# EAGLE schematic PULSE-SIEM_V2 (EAGLE 9.5.1)
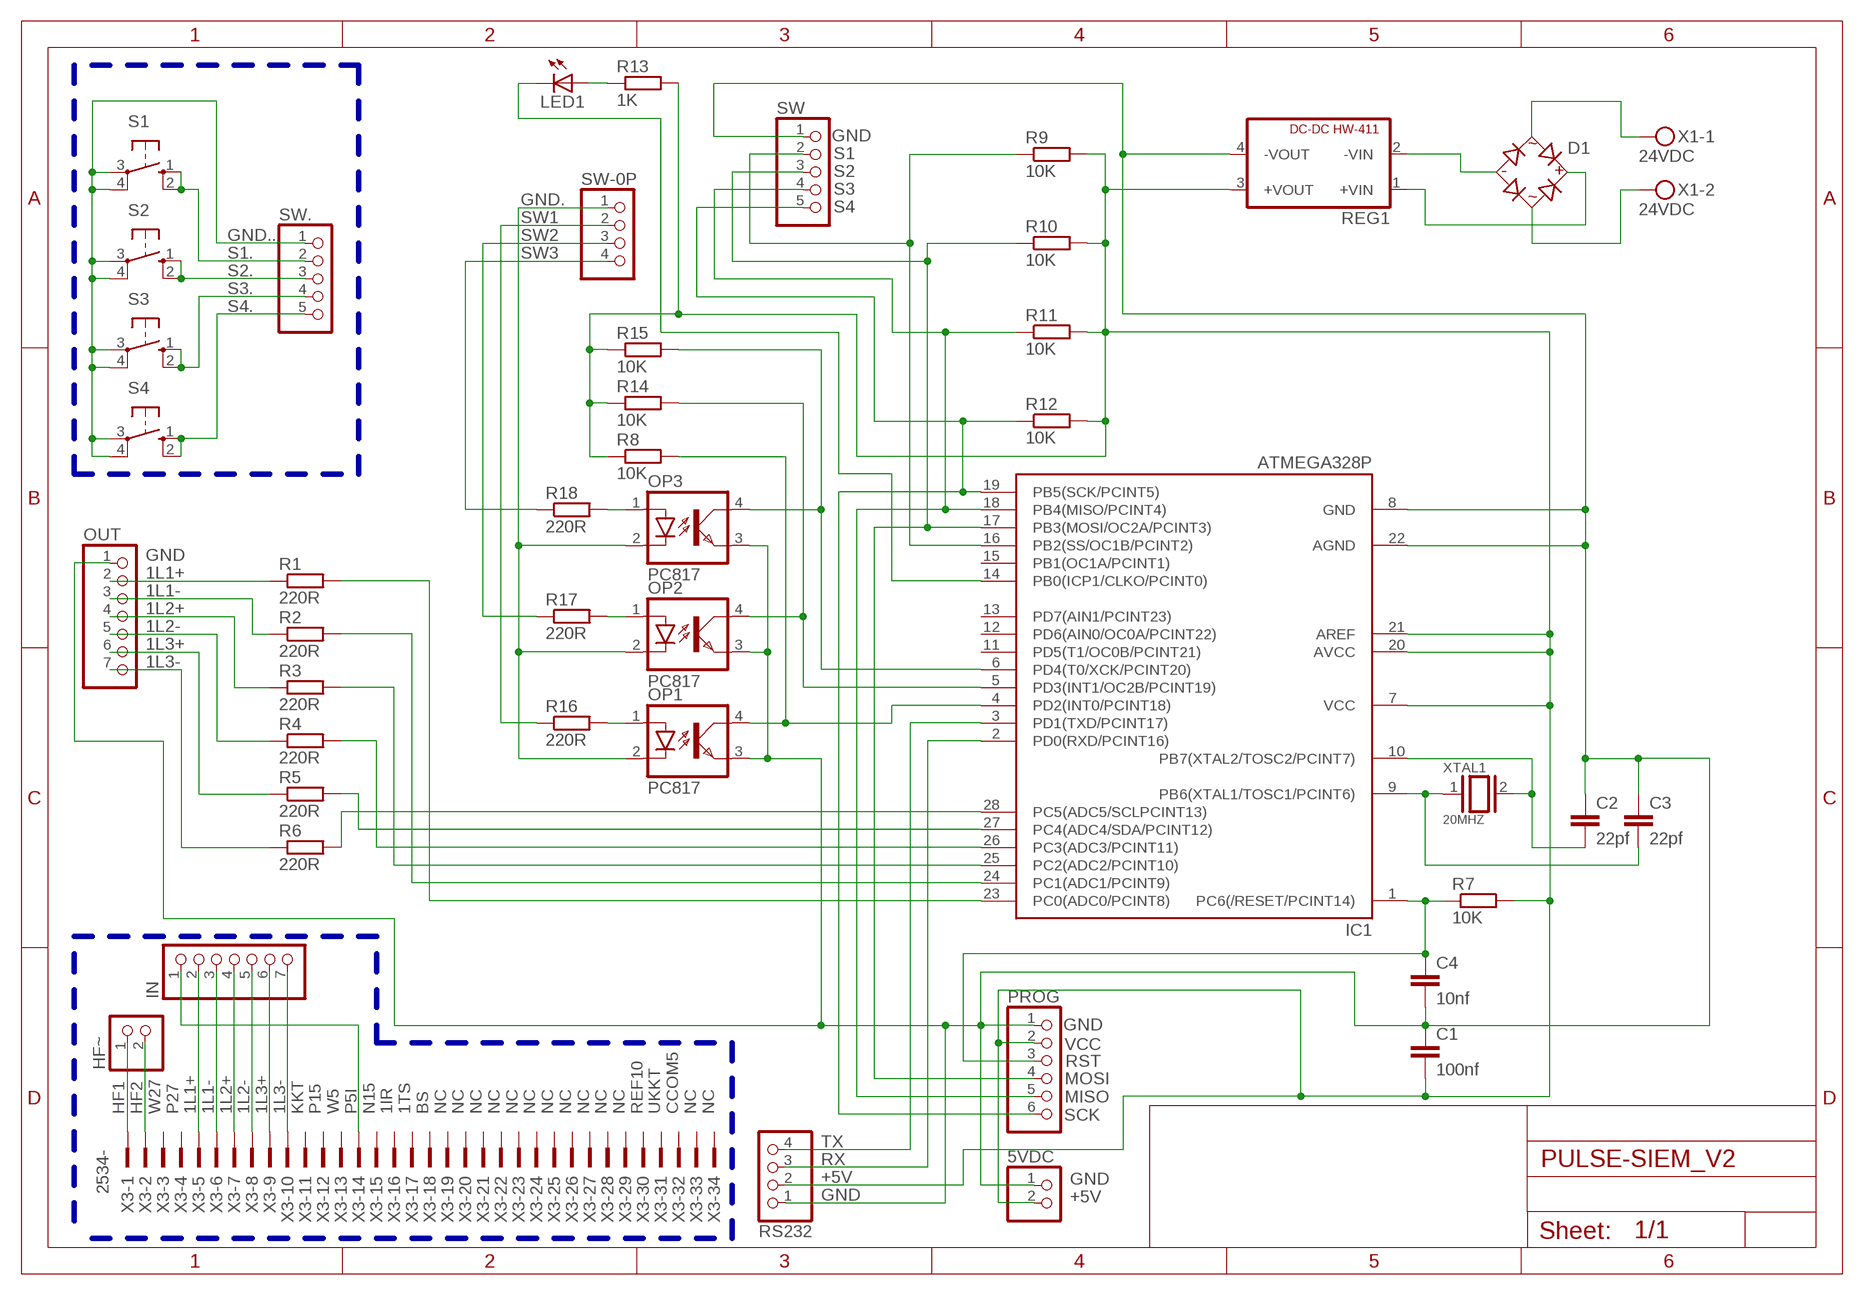
[diagram p0: schematic, sheet 1]

## Parts
5VDC  PINHD-1X2  [1X02]
C1  100nf  C-EU050-025X075  [C050-025X075]
C2  22pf  C-EU025-024X044  [C25-024X044]
C3  22pf  C-EU025-024X044  [C25-024X044]
C4  10nf  C-EU050-025X075  [C050-025X075]
D1  S1WBS80  [S1WBS80]
HF~  PINHD-1X2  [1X02]
IC1  ATMEGA328P  ATMEGA48/88/168-PU  [DIL28-3]
IN  PINHD-1X7  [1X07]
LED1  LED  [LED_5MM]
OP1  PC817  [DIL04]
OP2  PC817  [DIL04]
OP3  PC817  [DIL04]
OUT  PINHD-1X7  [1X07]
PROG  ICSP-AVR-6-PIN  [ICSP-AVR-6-PIN]
R1  220R  RESISTOR_1/4  [RESISTOR_1/4_7.5]
R2  220R  RESISTOR_1/4  [RESISTOR_1/4_7.5]
R3  220R  RESISTOR_1/4  [RESISTOR_1/4_7.5]
R4  220R  RESISTOR_1/4  [RESISTOR_1/4_7.5]
R5  220R  RESISTOR_1/4  [RESISTOR_1/4_7.5]
R6  220R  RESISTOR_1/4  [RESISTOR_1/4_7.5]
R7  10K  RESISTOR_1/4  [RESISTOR_1/4_7.5]
R8  10K  RESISTOR_1/4  [RESISTOR_1/4_7.5]
R9  10K  RESISTOR_1/4  [RESISTOR_1/4_7.5]
R10  10K  RESISTOR_1/4  [RESISTOR_1/4_7.5]
R11  10K  RESISTOR_1/4  [RESISTOR_1/4_7.5]
R12  10K  RESISTOR_1/4  [RESISTOR_1/4_7.5]
R13  1K  RESISTOR_1/4  [RESISTOR_1/4_7.5]
R14  10K  RESISTOR_1/4  [RESISTOR_1/4_7.5]
R15  10K  RESISTOR_1/4  [RESISTOR_1/4_7.5]
R16  220R  RESISTOR_1/4  [RESISTOR_1/4_7.5]
R17  220R  RESISTOR_1/4  [RESISTOR_1/4_7.5]
R18  220R  RESISTOR_1/4  [RESISTOR_1/4_7.5]
REG1  LM2596_DC-DC_HW-411  [LM2596_DC-DC_HW-411]
RS232  PINHD-1X4  [1X04]
S1  10-XX  [B3F-10XX]
S2  10-XX  [B3F-10XX]
S3  10-XX  [B3F-10XX]
S4  10-XX  [B3F-10XX]
SW  PINHD-1X5  [1X05]
SW-0P  PINHD-1X4  [1X04]
SW.  PINHD-1X5  [1X05]
X1  24VDC  MKDSN1,5/2-5,08  [MKDSN1,5/2-5,08]
X3  2534-  [PAK100/2500-34]
XTAL1  20MHZ  XTAL/S  [QS]

## Nets
1L1+: OUT.2 R1.1
1L1-: OUT.3 R2.1
1L2+: OUT.4 R3.1
1L2-: OUT.5 R4.1
1L3+: OUT.6 R5.1
1L3-: OUT.7 R6.1
+5V: 5VDC.2 C1.2 IC1.7(VCC) IC1.20(AVCC) IC1.21(AREF) PROG.2(VCC) R7.2 R8.1 R9.2 R10.2 R11.2 R12.2 R13.2 R14.1 R15.1 REG1.3(+VOUT) RS232.2
GND: 5VDC.1 C1.1 C2.1 C3.1 C4.2 IC1.8(GND) IC1.22(AGND) OP1.3(EMIT) OP2.3(EMIT) OP3.3(EMIT) OUT.1 PROG.1(GND) REG1.4(-VOUT) RS232.1 SW.1
GND.: OP1.2(C) OP2.2(C) OP3.2(C) SW-0P.1
GND..: S1.3(P) S1.4(P1) S2.3(P) S2.4(P1) S3.3(P) S3.4(P1) S4.3(P) S4.4(P1) SW..1
N$1: IC1.4(PD2(INT0/PCINT18)) OP1.4(COL) R8.2
N$2: IC1.5(PD3(INT1/OC2B/PCINT19)) OP2.4(COL) R14.2
N$3: IC1.6(PD4(T0/XCK/PCINT20)) OP3.4(COL) R15.2
N$4: OP1.1(A) R16.2
N$5: OP2.1(A) R17.2
N$6: OP3.1(A) R18.2
N$7: HF~.1 X3.1
N$8: IN.2 X3.5
N$9: C2.2 IC1.10(PB7(XTAL2/TOSC2/PCINT7)) XTAL1.2
N$10: C4.1 IC1.1(PC6(/RESET/PCINT14)) PROG.3(RST) R7.1
N$12: C3.2 IC1.9(PB6(XTAL1/TOSC1/PCINT6)) XTAL1.1
N$13: HF~.2 X3.2
N$17: IC1.23(PC0(ADC0/PCINT8)) R1.2
N$18: IC1.24(PC1(ADC1/PCINT9)) R2.2
N$19: IC1.25(PC2(ADC2/PCINT10)) R3.2
N$20: IC1.26(PC3(ADC3/PCINT11)) R4.2
N$21: IC1.27(PC4(ADC4/SDA/PCINT12)) R5.2
N$22: IC1.28(PC5(ADC5/SCLPCINT13)) R6.2
N$23: IN.3 X3.6
N$24: IN.4 X3.7
N$25: IN.5 X3.8
N$26: IC1.14(PB0(ICP1/CLKO/PCINT0)) LED1.K(C)
N$27: LED1.A R13.1
N$29: IN.6 X3.9
N$30: IN.7 X3.10
N$31: IN.1 X3.14
N$33: D1.~(AC1) X1.1
N$34: D1.~~(AC2) X1.2
N$35: D1.- REG1.2(-VIN)
N$36: D1.+ REG1.1(+VIN)
RX: IC1.2(PD0(RXD/PCINT16)) RS232.3
S1: IC1.16(PB2(SS/OC1B/PCINT2)) R9.1 SW.2
S1.: S1.1(S) S1.2(S1) SW..2
S2: IC1.17(PB3(MOSI/OC2A/PCINT3)) PROG.4(MOSI) R10.1 SW.3
S2.: S2.1(S) S2.2(S1) SW..3
S3: IC1.18(PB4(MISO/PCINT4)) PROG.5(MISO) R11.1 SW.4
S3.: S3.1(S) S3.2(S1) SW..4
S4: IC1.19(PB5(SCK/PCINT5)) PROG.6(SCK) R12.1 SW.5
S4.: S4.1(S) S4.2(S1) SW..5
SW1: R16.1 SW-0P.2
SW2: R17.1 SW-0P.3
SW3: R18.1 SW-0P.4
TX: IC1.3(PD1(TXD/PCINT17)) RS232.4
Unconnected: IC1.11(PD5(T1/OC0B/PCINT21)) IC1.12(PD6(AIN0/OC0A/PCINT22)) IC1.13(PD7(AIN1/PCINT23)) IC1.15(PB1(OC1A/PCINT1)) X3.3 X3.4 X3.11 X3.12 X3.13 X3.15 X3.16 X3.17 X3.18 X3.19 X3.20 X3.21 X3.22 X3.23 X3.24 X3.25 X3.26 X3.27 X3.28 X3.29 X3.30 X3.31 X3.32 X3.33 X3.34

## Buses
B$1

## Notes on the sheet
- HF1
  HF2
  W27
  P27
  1L1+
  1L1-
  1L2+
  1L2-
  1L3+
  1L3-
  KKT
  P15
  W5
  P5I
  N15
  1IR
  1TS
  BS
  NC
  NC
  NC
  NC
  NC
  NC
  NC
  NC
  NC
  NC
  NC
  REF10
  UKKT
  CCOM5
  NC
  NC

## Library data of the parts
5VDC HF~ = pinhead:PINHD-1X2: PIN HEADER
C1-C4 = 00-tecnicosotv:C-EU: CAPACITOR, European symbol
D1 = 00-tecnicosotv:S1WBS80: SW1BS80 - 800V 1A
IC1 = atmega8:ATMEGA48/88/168-PU
IN OUT = pinhead:PINHD-1X7: PIN HEADER
LED1 = 00-tecnicosotv:LED: LED
OP1-OP3 = optocoupler:PC817: SHARP OPTO COUPLER; MPN: PC817X4J000F; OC_FARNELL: 9707727; OC_NEWARK: 97K7059
PROG = 00-tecnicosotv:ICSP-AVR-6-PIN: PIN HEADER
R1-R18 = 00-tecnicosotv:RESISTOR_1/4
REG1 = 00-tecnicosotv:LM2596_DC-DC_HW-411: LM2596 DC-DC HW-411
RS232 SW-0P = pinhead:PINHD-1X4: PIN HEADER
S1-S4 = switch-omron:10-XX: OMRON SWITCH; MPN: B3F-1000; OC_FARNELL: 176432; OC_NEWARK: 36M3542
SW SW. = pinhead:PINHD-1X5: PIN HEADER
X1 = 00-tecnicosotv:MKDSN1,5/2-5,08: MKDSN 1,5/ 2-5,08 Printklemme Nennstrom: 13,5 A Nennspannung: 250 V Rastermaß: 5,08 mm Polzahl: 2 Anschlussart: Schraubanschluss Montage: Löten Anschlussrichtung Leiter/Platine: 0 ° Artikelnummer: 1729128 Source: http://eshop.phoenixcontact.com .. 1729128.pdf
X3 = con-3m:2534-: 3M (TM) Pak 100 4-Wall Header Source: 3M; OC_FARNELL: unknown; OC_NEWARK: unknown
XTAL1 = 00-tecnicosotv:XTAL/S: CRYSTAL